# Altium schematic sheet BlueToothi.SchDoc
size A4
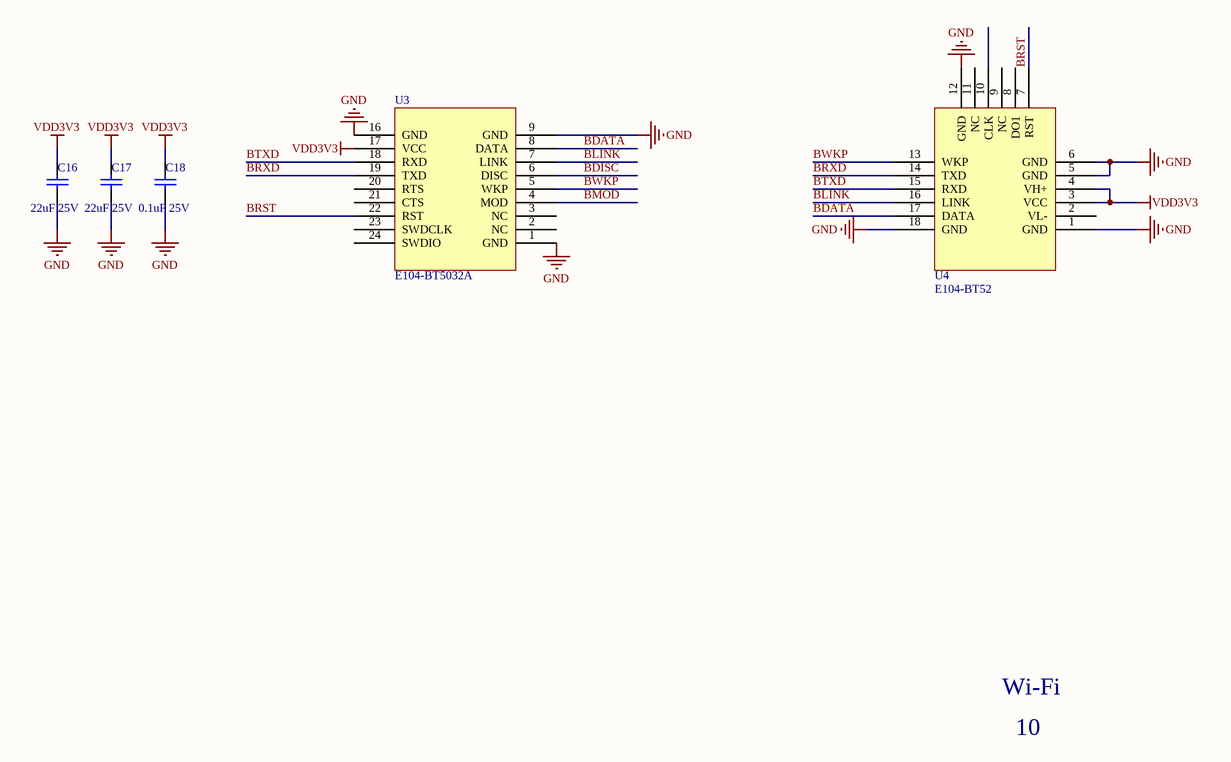
[diagram p0: BlueToothi.SchDoc]

## Parts
C16  22uF 25V  [SMD-0805C]
C17  22uF 25V  [SMD-0805C]
C18  0.1uF 25V  [SMD-0805C]
U3  E104-BT5032A  [E104-BT503]
U4  E104-BT52  [E104-BT52]

## Nets
GND: C16.1 C17.1 C18.1 U3.1(GND) U3.9(GND) U3.16(GND) U4.1(GND) U4.5(GND) U4.6(GND) U4.12(GND) U4.18(GND)
VDD3V3: C16.2 C17.2 C18.2 U3.17(VCC) U4.3(VCC) U4.4(VH+)
BDATA: U3.8(DATA) U4.17(DATA)
BDISC: U3.6(DISC)
BLINK: U3.7(LINK) U4.16(LINK)
BMOD: U3.4(MOD)
BRST: U3.22(RST) U4.7(RST)
BRXD: U3.19(TXD) U4.14(TXD)
BTXD: U3.18(RXD) U4.15(RXD)
BWKP: U3.5(WKP) U4.13(WKP)

Not connected (* = marked no-connect by the designer): U3 2(NC) 3(NC) 20(RTS) 21(CTS) 23(SWDCLK) 24(SWDIO); U4 2(VL-) 8(DO1) 9(NC) 10(CLK) 11(NC)

## Notes on the sheet
- Wi-Fi
- 10

## Library data of the parts
C16-C18 = CAP4: 贴片电容 20%
U3 = E104-BT503